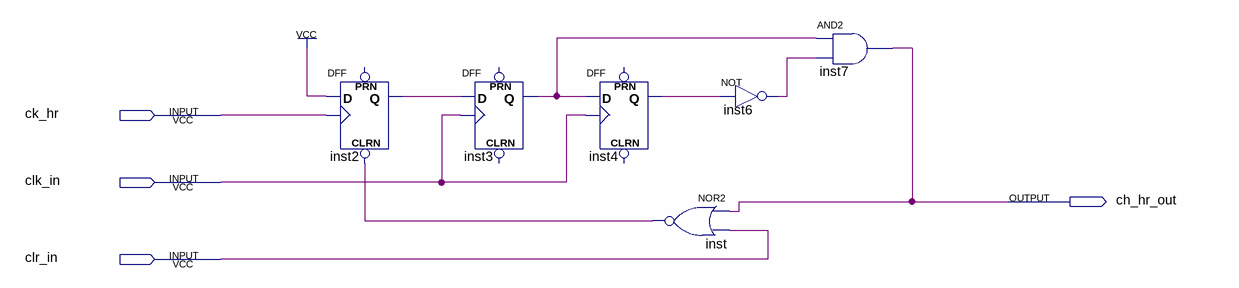
[diagram p0: schematic sheet]
// Quartus schematic ck_hr.bdf as structural Verilog: 6 symbols, 4 pins
module ck_hr (
  input  ck_hr,
  input  clk_in,
  input  clr_in,
  output ch_hr_out
);

  wire inst2_q, inst3_q, inst4_q, inst6_out, inst_out;

  DFF inst2 (.CLRN(inst_out), .CLK(ck_hr), .D(1'b1), .Q(inst2_q));  // open: PRN
  DFF inst3 (.CLK(clk_in), .D(inst2_q), .Q(inst3_q));  // open: CLRN, PRN
  DFF inst4 (.CLK(clk_in), .D(inst3_q), .Q(inst4_q));  // open: CLRN, PRN
  nor inst (inst_out, ch_hr_out, clr_in);
  not inst6 (inst6_out, inst4_q);
  and inst7 (ch_hr_out, inst3_q, inst6_out);
endmodule
